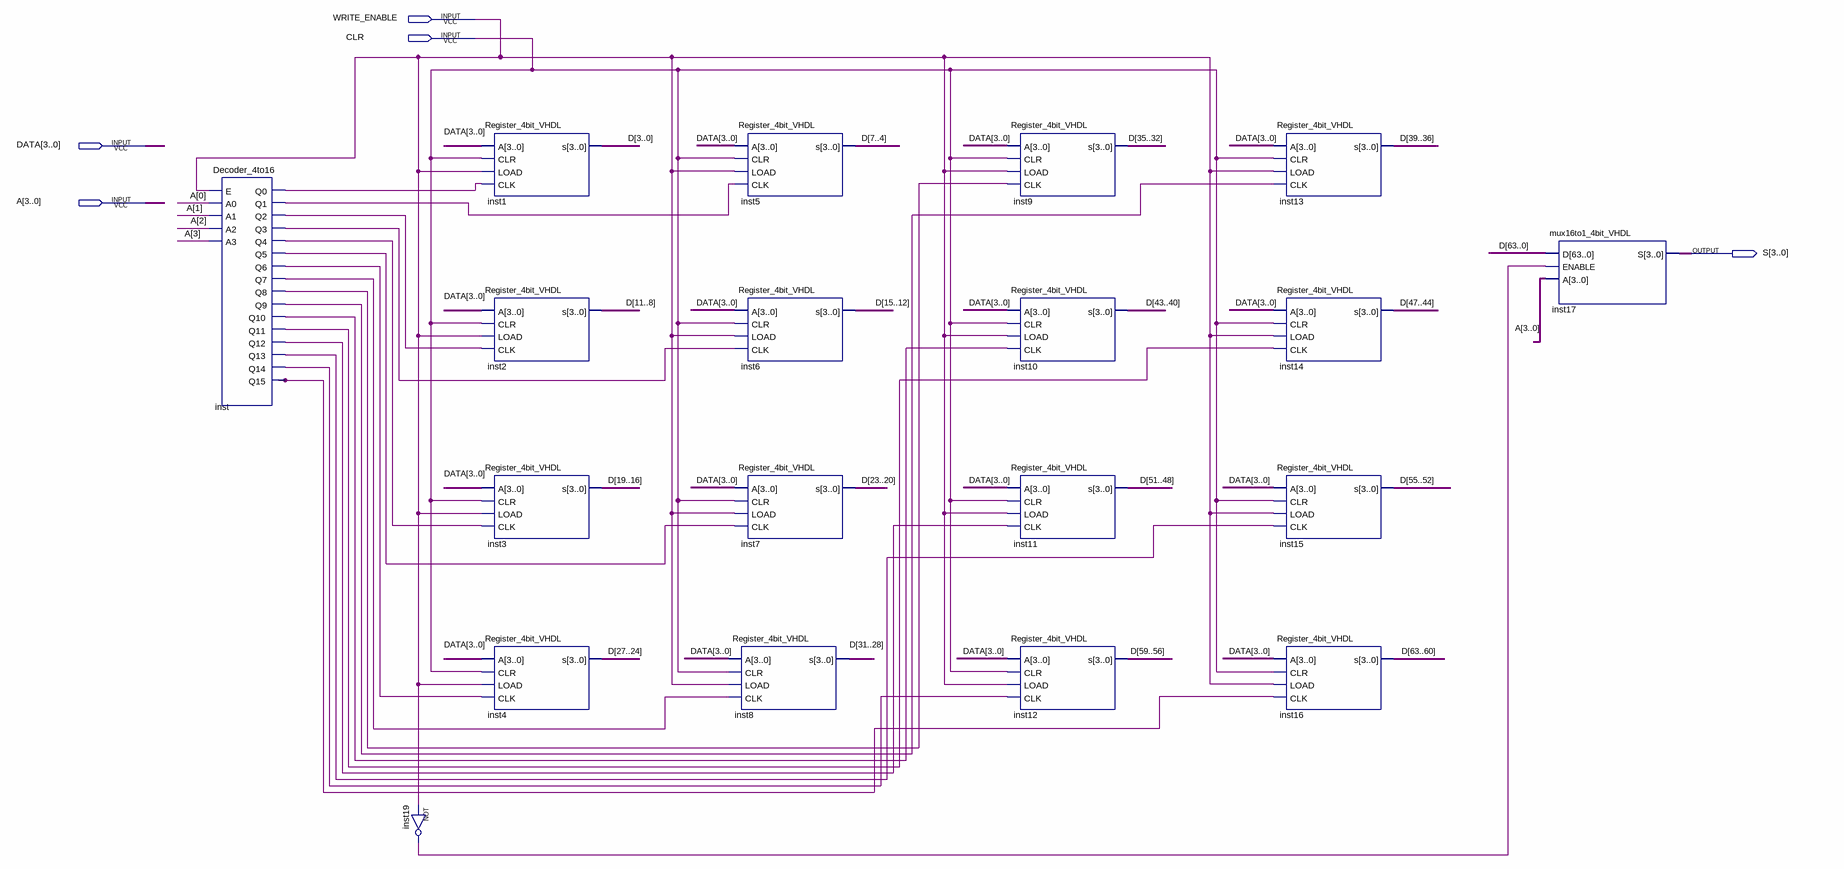
[diagram p0: schematic sheet]
// Quartus schematic ram_module16_4bit.bdf as structural Verilog: 19 symbols, 5 pins
module ram_module16_4bit (
  input  WRITE_ENABLE,
  input  CLR,
  input  [3:0] DATA,
  input  [3:0] A,
  output [3:0] S
);

  wire inst19_out, inst_q0, inst_q1, inst_q2, inst_q3, inst_q4, inst_q5, inst_q6, inst_q7, inst_q8, inst_q9,
       inst_q10, inst_q11, inst_q12, inst_q13, inst_q14, inst_q15;
  wire [63:0] D;

  Decoder_4to16 inst (
    .E(WRITE_ENABLE), .A0(A[0]), .A1(A[1]), .A2(A[2]), .A3(A[3]), .Q0(inst_q0), .Q1(inst_q1), .Q2(inst_q2),
    .Q3(inst_q3), .Q4(inst_q4), .Q5(inst_q5), .Q6(inst_q6), .Q7(inst_q7), .Q8(inst_q8), .Q9(inst_q9),
    .Q10(inst_q10), .Q11(inst_q11), .Q12(inst_q12), .Q13(inst_q13), .Q14(inst_q14), .Q15(inst_q15));
  not inst19 (inst19_out, WRITE_ENABLE);
  Register_4bit_VHDL inst1 (.A(DATA), .CLR(CLR), .LOAD(WRITE_ENABLE), .CLK(inst_q0), .s(D[3:0]));
  Register_4bit_VHDL inst2 (.A(DATA), .CLR(CLR), .LOAD(WRITE_ENABLE), .CLK(inst_q2), .s(D[11:8]));
  Register_4bit_VHDL inst3 (.A(DATA), .CLR(CLR), .LOAD(WRITE_ENABLE), .CLK(inst_q4), .s(D[19:16]));
  Register_4bit_VHDL inst4 (.A(DATA), .CLR(CLR), .LOAD(WRITE_ENABLE), .CLK(inst_q6), .s(D[27:24]));
  Register_4bit_VHDL inst5 (.A(DATA), .CLR(CLR), .LOAD(WRITE_ENABLE), .CLK(inst_q1), .s(D[7:4]));
  Register_4bit_VHDL inst6 (.A(DATA), .CLR(CLR), .LOAD(WRITE_ENABLE), .CLK(inst_q3), .s(D[15:12]));
  Register_4bit_VHDL inst7 (.A(DATA), .CLR(CLR), .LOAD(WRITE_ENABLE), .CLK(inst_q5), .s(D[23:20]));
  Register_4bit_VHDL inst8 (.A(DATA), .CLR(CLR), .LOAD(WRITE_ENABLE), .CLK(inst_q7), .s(D[31:28]));
  Register_4bit_VHDL inst9 (.A(DATA), .CLR(CLR), .LOAD(WRITE_ENABLE), .CLK(inst_q8), .s(D[35:32]));
  Register_4bit_VHDL inst10 (.A(DATA), .CLR(CLR), .LOAD(WRITE_ENABLE), .CLK(inst_q10), .s(D[43:40]));
  Register_4bit_VHDL inst11 (.A(DATA), .CLR(CLR), .LOAD(WRITE_ENABLE), .CLK(inst_q12), .s(D[51:48]));
  Register_4bit_VHDL inst12 (.A(DATA), .CLR(CLR), .LOAD(WRITE_ENABLE), .CLK(inst_q14), .s(D[59:56]));
  Register_4bit_VHDL inst13 (.A(DATA), .CLR(CLR), .LOAD(WRITE_ENABLE), .CLK(inst_q9), .s(D[39:36]));
  Register_4bit_VHDL inst14 (.A(DATA), .CLR(CLR), .LOAD(WRITE_ENABLE), .CLK(inst_q11), .s(D[47:44]));
  Register_4bit_VHDL inst15 (.A(DATA), .CLR(CLR), .LOAD(WRITE_ENABLE), .CLK(inst_q13), .s(D[55:52]));
  Register_4bit_VHDL inst16 (.A(DATA), .CLR(CLR), .LOAD(WRITE_ENABLE), .CLK(inst_q15), .s(D[63:60]));
  mux16to1_4bit_VHDL inst17 (.D(D), .ENABLE(inst19_out), .A(A), .S(S));
endmodule
